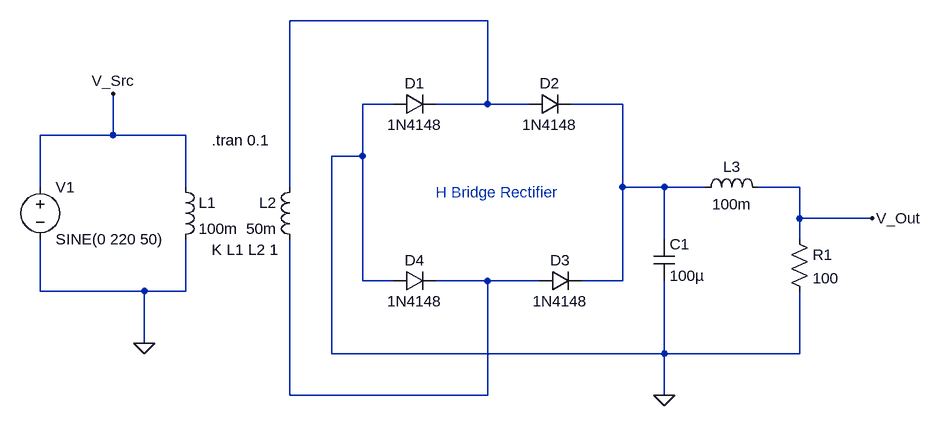
[diagram p0: schematic H_Bridge_Rectifier.asc]
H_Bridge_Rectifier.asc, the LTspice schematic file:
Version 4.1
SHEET 1 904 680
WIRE 224 -176 -80 -176
WIRE 80 -48 32 -48
WIRE 224 -48 224 -176
WIRE 224 -48 144 -48
WIRE 288 -48 224 -48
WIRE 432 -48 352 -48
WIRE -352 0 -352 -64
WIRE -352 0 -464 0
WIRE -240 0 -352 0
WIRE 32 32 32 -48
WIRE 32 32 -16 32
WIRE -464 80 -464 0
WIRE -240 80 -240 0
WIRE -80 80 -80 -176
WIRE 432 80 432 -48
WIRE 496 80 432 80
WIRE 560 80 496 80
WIRE 704 80 640 80
WIRE 704 128 704 80
WIRE 816 128 704 128
WIRE 496 160 496 80
WIRE 704 160 704 128
WIRE 32 224 32 32
WIRE 80 224 32 224
WIRE 224 224 144 224
WIRE 304 224 224 224
WIRE 432 224 432 80
WIRE 432 224 368 224
WIRE -464 240 -464 160
WIRE -304 240 -464 240
WIRE -240 240 -240 160
WIRE -240 240 -304 240
WIRE -304 320 -304 240
WIRE -16 336 -16 32
WIRE 496 336 496 224
WIRE 496 336 -16 336
WIRE 704 336 704 240
WIRE 704 336 496 336
WIRE -80 400 -80 160
WIRE 224 400 224 224
WIRE 224 400 -80 400
WIRE 496 400 496 336
FLAG 496 400 0
FLAG -304 320 0
FLAG -352 -64 V_Src
FLAG 816 128 V_Out
SYMBOL voltage -464 64 R0
WINDOW 123 0 0 Left 0
WINDOW 39 0 0 Left 0
SYMATTR InstName V1
SYMATTR Value SINE(0 220 50)
SYMBOL ind -256 64 R0
SYMATTR InstName L1
SYMATTR Value 100m
SYMATTR Type ind
SYMATTR SpiceLine Rser=1m
SYMBOL ind -64 64 M0
SYMATTR InstName L2
SYMATTR Value 50m
SYMATTR Type ind
SYMATTR SpiceLine Rser=1m
SYMBOL diode 80 -64 M90
WINDOW 0 0 32 VBottom 2
WINDOW 3 32 32 VTop 2
SYMATTR InstName D1
SYMATTR Value 1N4148
SYMBOL diode 288 -64 M90
WINDOW 0 0 32 VBottom 2
WINDOW 3 32 32 VTop 2
SYMATTR InstName D2
SYMATTR Value 1N4148
SYMBOL diode 304 208 M90
WINDOW 0 0 32 VBottom 2
WINDOW 3 32 32 VTop 2
SYMATTR InstName D3
SYMATTR Value 1N4148
SYMBOL diode 80 208 M90
WINDOW 0 0 32 VBottom 2
WINDOW 3 32 32 VTop 2
SYMATTR InstName D4
SYMATTR Value 1N4148
SYMBOL res 688 144 R0
SYMATTR InstName R1
SYMATTR Value 100
SYMBOL cap 480 160 R0
SYMATTR InstName C1
SYMATTR Value 100µ
SYMBOL ind 544 96 R270
WINDOW 0 32 56 VTop 2
WINDOW 3 5 56 VBottom 2
SYMATTR InstName L3
SYMATTR Value 100m
SYMATTR SpiceLine Rser=1m
TEXT -200 8 Left 2 !.tran 0.1
TEXT -200 176 Left 2 !K L1 L2 1
TEXT 144 88 Left 2 ;H Bridge Rectifier

The netlist it stands for:
* H_Bridge_Rectifier.asc
V1 V_Src 0 SINE(0 220 50)
L1 V_Src 0 100m Rser=1m
L2 N001 N003 50m Rser=1m
D1 0 N001 1N4148
D2 N001 N002 1N4148
D3 N003 N002 1N4148
D4 0 N003 1N4148
R1 V_Out 0 100
C1 N002 0 100µ
L3 N002 V_Out 100m Rser=1m
.model D D
.lib standard.dio
.tran 0.1
K L1 L2 1
* H Bridge Rectifier
.backanno
.end